# EAGLE design 2out_16A_bi_TS_V0.3 (EAGLE 7.4.0)
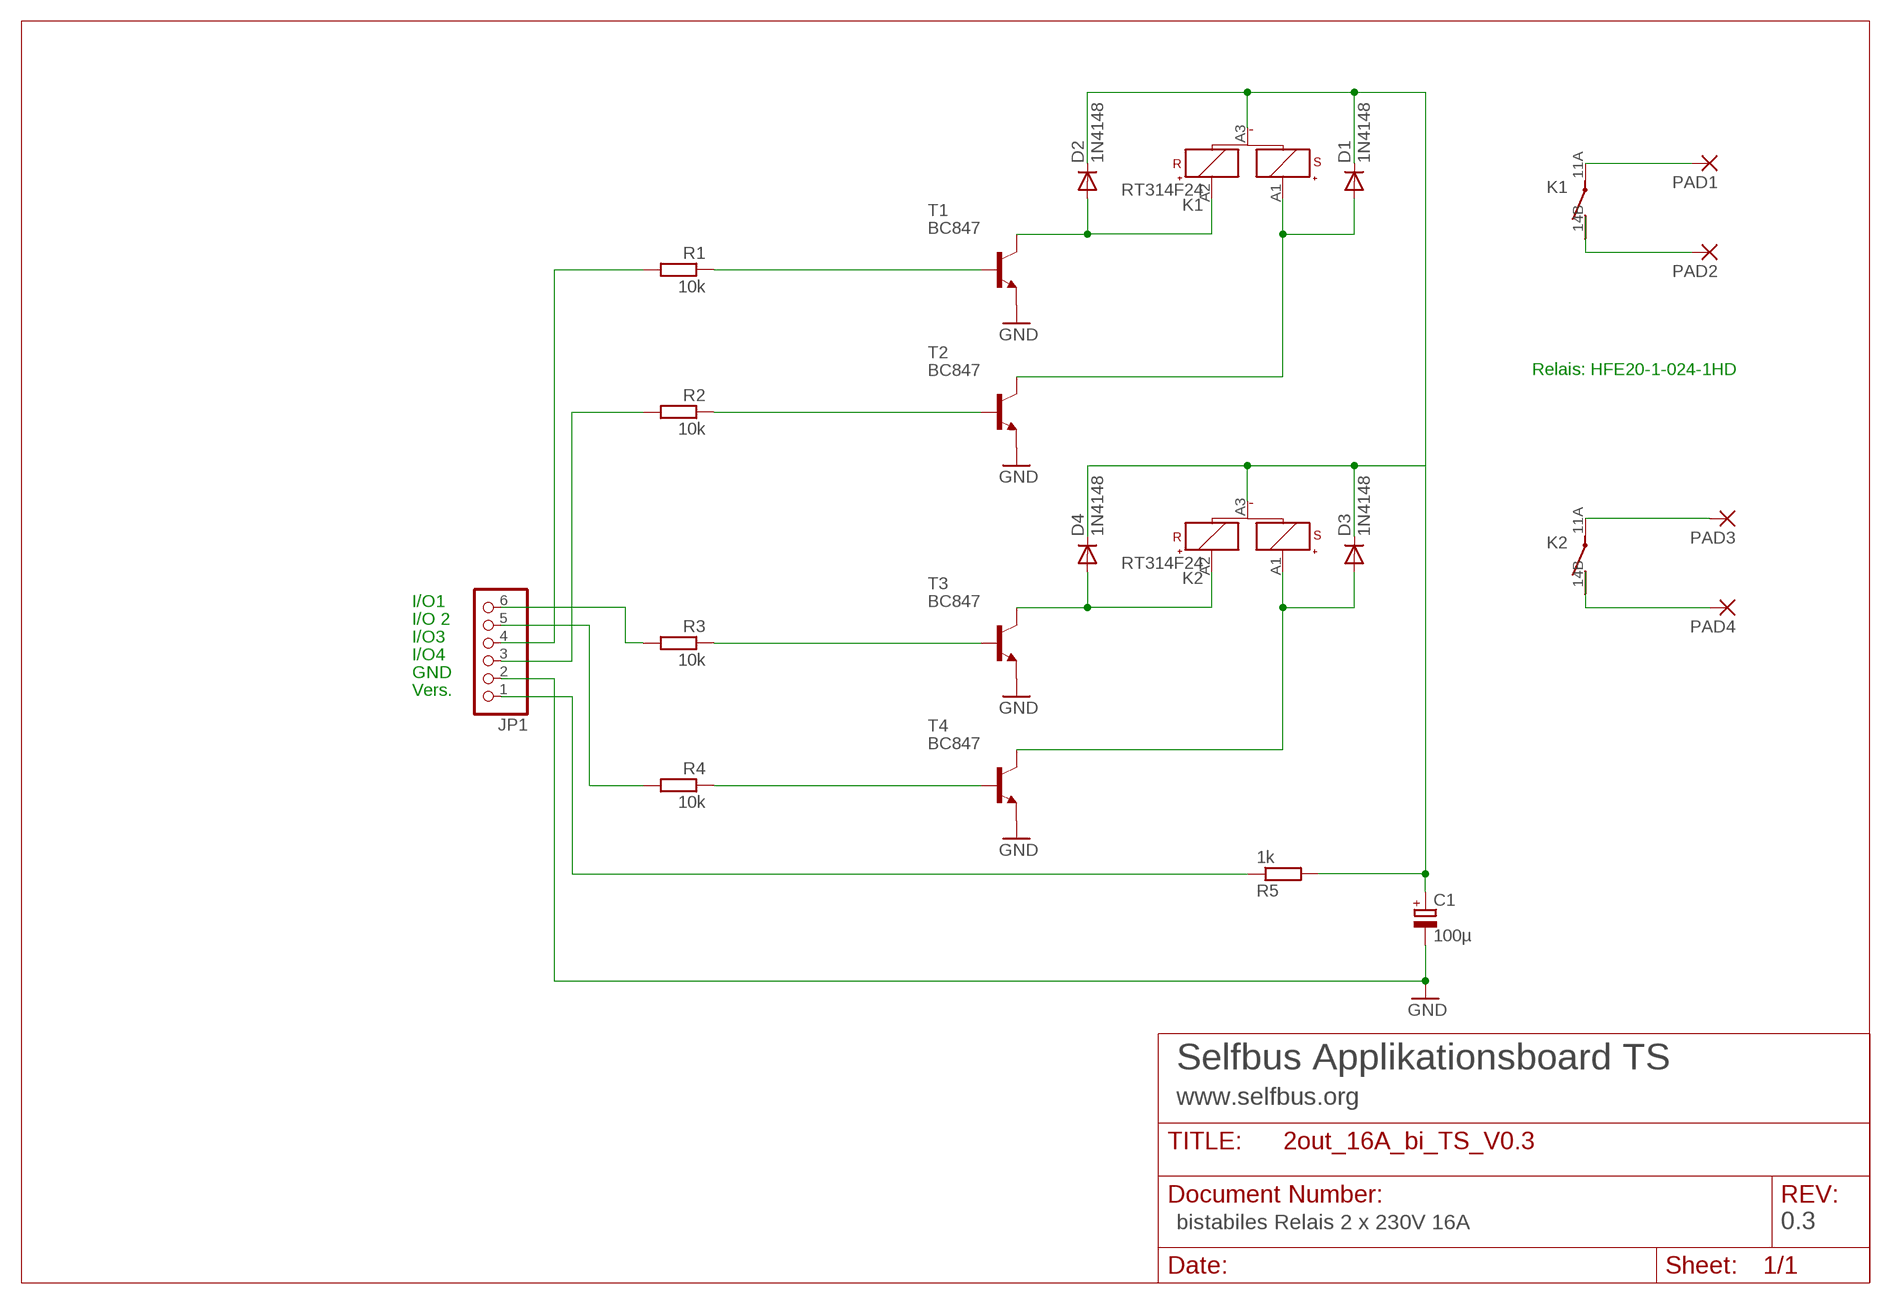
[diagram p0: schematic, sheet 1]

## Parts
C1  100µ  CPOL-EUE3.5-8  [E3,5-8]
D1  1N4148  DIODE-MINIMELF  [MINIMELF]
D2  1N4148  DIODE-MINIMELF  [MINIMELF]
D3  1N4148  DIODE-MINIMELF  [MINIMELF]
D4  1N4148  DIODE-MINIMELF  [MINIMELF]
JP1  PINHD-1X6/90  [1X06/90]
K1  RT314F24  [RT1-BI]
K2  RT314F24  [RT1-BI]
PAD1  3,81/1,4  [3,81/1,4]
PAD2  3,81/1,4  [3,81/1,4]
PAD3  3,81/1,4  [3,81/1,4]
PAD4  3,81/1,4  [3,81/1,4]
R1  10k  R-EU_M1206  [M1206]
R2  10k  R-EU_M1206  [M1206]
R3  10k  R-EU_M1206  [M1206]
R4  10k  R-EU_M1206  [M1206]
R5  1k  R-EU_M1206  [M1206]
T1  BC847  [SOT23]
T2  BC847  [SOT23]
T3  BC847  [SOT23]
T4  BC847  [SOT23]

## Nets
GND: C1.- JP1.2 T1.2(E) T2.2(E) T3.2(E) T4.2(E)
IO2: JP1.4 R1.2
N$1: R2.1 T2.1(B)
N$2: JP1.3 R2.2
N$3: K1.11A(PA) PAD1.1(P)
N$4: K1.14B(SA) PAD2.1(P)
N$5: K2.11A(PA) PAD3.1(P)
N$6: K2.14B(SA) PAD4.1(P)
N$7: JP1.6 R3.2
N$8: R3.1 T3.1(B)
N$9: R4.1 T4.1(B)
N$10: JP1.5 R4.2
N$14: R1.1 T1.1(B)
N$15: JP1.1 R5.1
R1: D1.A K1.A1(1:S+) T2.3(C)
R2: D4.A K2.A2(1:R+) T3.3(C)
R3: D2.A K1.A2(1:R+) T1.3(C)
R4: D3.A K2.A1(1:S+) T4.3(C)
VDD_IN: C1.+ D1.C D2.C D3.C D4.C K1.A3(1:-) K2.A3(1:-) R5.2

## Notes on the sheet
- Relais: HFE20-1-024-1HD
- I/O1
- I/O 2
- I/O3
- I/O4
- GND
- Vers.
- Selfbus Applikationsboard TS
- www.selfbus.org
- bistabiles Relais 2 x 230V 16A | 0.3

## Library data of the parts
C1 = rcl:CPOL-EU: POLARIZED CAPACITOR, European symbol
D1-D4 = diode:DIODE-: DIODE
JP1 = pinhead:PINHD-1X6: PIN HEADER
K1 K2 = meine_lib:RT?F*: Power PCB Relay SCHRACK bistable 1 pole 16 A, polarized bistable version Source: http://www.schrack.com/.. 5821.pdf; MPN: RT314F24; OC_FARNELL: 1175084; OC_NEWARK: 31M5918
PAD1-PAD4 = wirepad:3,81/1,4: THROUGH-HOLE PAD
R1-R5 = rcl:R-EU_: RESISTOR, European symbol
T1-T4 = transistor:BC847: NPN TRANSISTOR

## Board
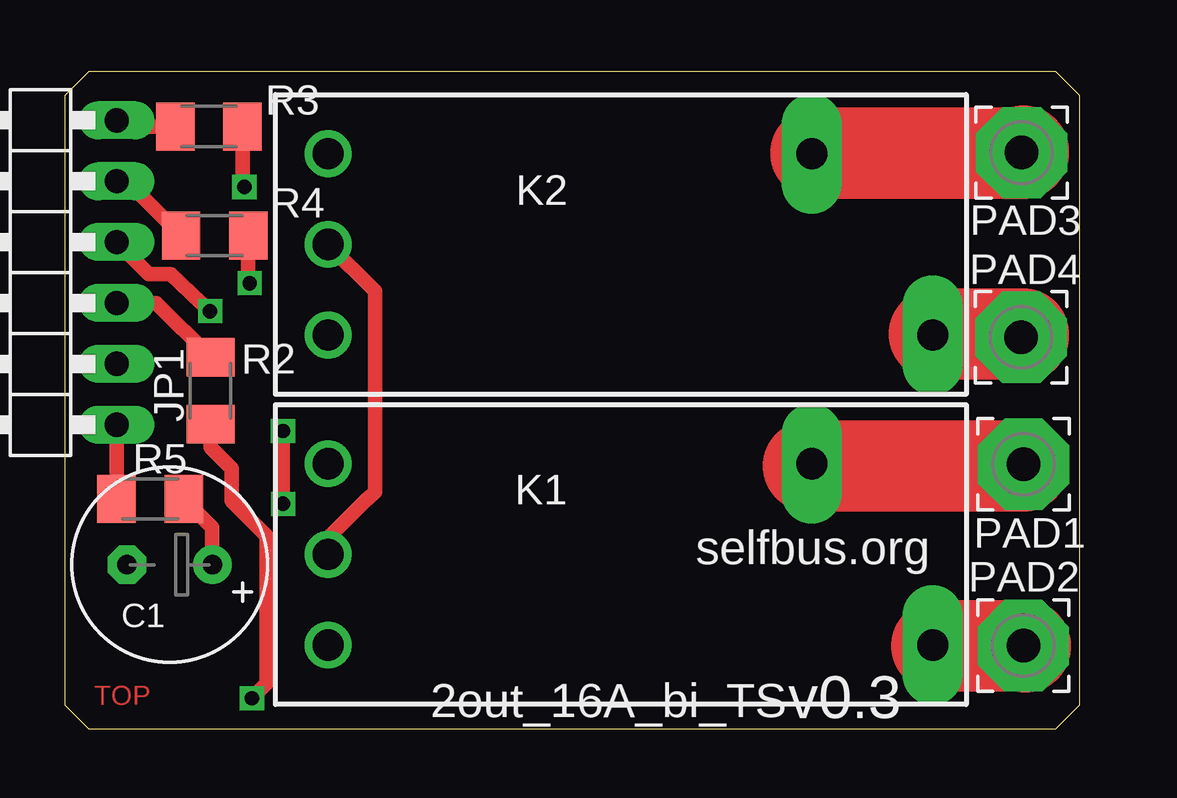
[diagram p1: board, top side]
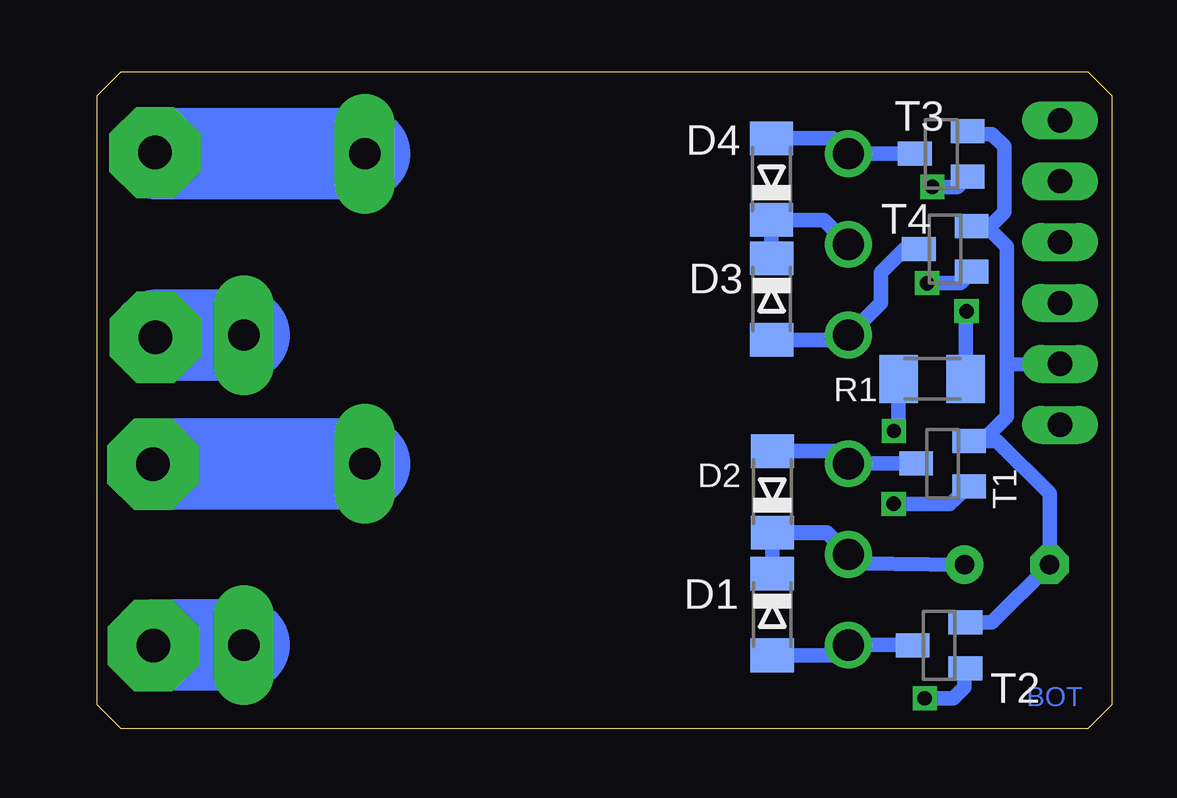
[diagram p2: board, bottom side, seen from below]

Size 42.3 x 27.4 mm. Coordinates in mm from the lower left corner, seen from the top.
Outline: 1,0 41.3,0 42.3,1 42.3,26.4 41.3,27.4 1,27.4 0,26.4 0,1 1,0
Copper layers (1*16): Top 0.035mm / dielectric 1.5mm / Bottom 0.035mm
Design rules "default_freebus": minimum track width 10mil, minimum drill 24mil, track to track 8mil, track to pad 8mil, pad to pad 8mil, via to via 8mil, smd to smd 8mil, copper to edge 12mil, drill to drill 8mil, minimum pad ring 11mil, minimum via ring 8mil, stop-mask expansion 4mil, vias tented up to drill 0mil, thermal gap 10mil

### Footprints (pad centres in the part's own frame; a part is rotated, then mirrored left to right if it is on the bottom)
E3,5-8 = drill 0.813 pad 1.6: + -1.778,0 | drill 0.813 pad 1.6 octagon: - 1.778,0
MINIMELF = smd 1.4 x 1.8: A 1.7,0; C -1.7,0
1X06/90 = drill 1.016 long: 1 -6.35,-3.81; 2 -3.81,-3.81; 3 -1.27,-3.81; 4 1.27,-3.81; 5 3.81,-3.81; 6 6.35,-3.81
RT1-BI = drill 1.3 pad 2.5 long: 11A 7.56,3.78; 14B 12.6,-3.78 | drill 1.3: A1 -12.6,-3.78; A2 -12.6,3.78; A3 -12.6,0
3,81/1,4 = drill 1.397 pad 3.81 octagon: 1 0,0
M1206 = smd 1.6 x 2: 1 -1.4,0; 2 1.4,0
SOT23 = smd 1 x 1.4: 1 -0.95,-1.1; 2 0.95,-1.1; 3 0,1.1

### Placement (x,y rotation side)
C1  4.37,6.84 180 top
D1  14.15,4.76 270 bottom
D2  14.15,9.87 90 bottom
D3  14.18,17.91 270 bottom
D4  14.19,22.91 90 bottom
JP1  -1.65,19.02 90 top
K1  23.58,7.26 0 top
K2  23.58,20.19 0 top
PAD1  39.96,11.02 0 top
PAD2  39.95,3.45 0 top
PAD3  39.89,24.02 0 top
PAD4  39.87,16.32 0 top
R1  7.49,14.58 0 bottom
R2  6.07,14.09 90 top
R3  6.01,25.1 180 top
R4  6.25,20.55 180 top
R5  3.56,9.57 0 top
T1  7.05,11.05 90 bottom
T2  7.2,3.47 90 bottom
T3  7.11,23.97 90 bottom
T4  6.94,20 90 bottom

### Tracks (layer width: path | path; a pad name or v marks a point on that pad's centre or on a via)
GND
  Bottom 0.61: T1.2 5.4,12 | T2.2 5,4.42 C1.- 2.59,9.8 4.78,12 5.4,12 | T4.2 5.23,20.95 | 5.23,20.95 5.06,20.95 4.49,21.53 4.49,24.28 4.99,24.78 5.87,24.78 T3.2 | 5.4,12 4.38,13.01 4.37,15.19 | 4.37,15.19 4.38,20.1 5.23,20.95 | JP1.2 3.3,15.2 4.37,15.19
IO2  (via drill 0.6)
  Top 0.61: JP1.4 3.49,18.95 4.42,18.95 5.69,17.75 v6.05,17.4
  Bottom 0.61: v6.05,17.4 6.09,17.43 R1.2
N$1  (via drill 0.6)
  Top 0.61: R2.1 6.07,11.72 6.95,10.84 6.95,9.5 8.42,8.04 8.42,1.88 v7.8,1.26
  Bottom 0.61: v7.8,1.26 6.6,1.26 6.14,1.73 6.14,2.49 T2.1
N$2
  Top 0.61: R2.2 3.81,17.75 JP1.3
N$3
  Bottom 3.81: K1.11A 39.93,11.04 PAD1.1
N$4
  Bottom 3.81: K1.14B 39.92,3.48 PAD2.1
N$5
  Bottom 3.81: K2.11A 39.84,23.97 PAD3.1
N$6
  Bottom 3.81: K2.14B 39.77,16.41 PAD4.1
N$7
  Top 0.61: JP1.6 2.16,25.1 R3.2
N$8  (via drill 0.6)
  Top 0.61: v7.48,22.59 7.41,22.66 R3.1
  Bottom 0.61: T3.1 6.44,22.59 v7.48,22.59
N$9  (via drill 0.6)
  Top 0.61: v7.7,18.57 7.65,18.62 R4.1
  Bottom 0.61: T4.1 6.32,18.57 v7.7,18.57
N$10
  Top 0.61: JP1.5 2.58,22.83 R4.2
N$11
  Top 3.81: 31.31,23.99 39.96,23.99 39.96,24.07
N$12
  Top 3.81: 36.24,16.46 39.96,16.46 39.96,16.34
N$13
  Top 3.81: 31,10.95 39.96,10.95 39.96,11.03
N$14  (via drill 0.6)
  Top 0.61: v9.09,9.38 9.09,10.41 v9.09,12.41
  Bottom 0.61: T1.1 6.75,9.37 v9.09,9.38 | v9.09,12.41 8.89,12.61 R1.1
N$15
  Top 0.61: JP1.1 R5.1
N$16
  Top 3.81: 36.35,3.46 40.03,3.46 40.03,3.42
R1
  Bottom 0.61: D1.A 11.4,3.06 K1.A1 8.32,3.48 T2.3
R2
  Bottom 0.61: T3.3 K2.A2 11.62,24.61 D4.A
R3
  Bottom 0.61: D2.A 11.5,11.57 K1.A2 T1.3
R4
  Bottom 0.61: D3.A 11.18,16.21 K2.A1 9.63,17.75 9.63,19.02 8.65,20 T4.3
VDD_IN  (via drill 0.6)
  Top 0.61: v10.98,7.28 10.98,7.95 12.6,9.57 12.62,9.57 12.93,9.87 12.93,18.24 K2.A3 | R5.2 6.14,8.39 C1.+
  Bottom 0.61: K2.A3 12,21.21 D4.C 14.18,19.84 14.66,19.37 14.16,19.37 13.95,19.58 14.14,19.58 D3.C | D2.C 11.88,8.17 K1.A3 10.55,6.88 C1.+ | D2.C D1.C | D2.C 11.87,8.17 v10.98,7.28

### Text on the board
Top: TOP
Bottom: BOT
tNames: selfbus.org | 2out_16A_bi_TS | v0.3